# EAGLE design 1604_lora_rak811 (EAGLE 9.6.2)
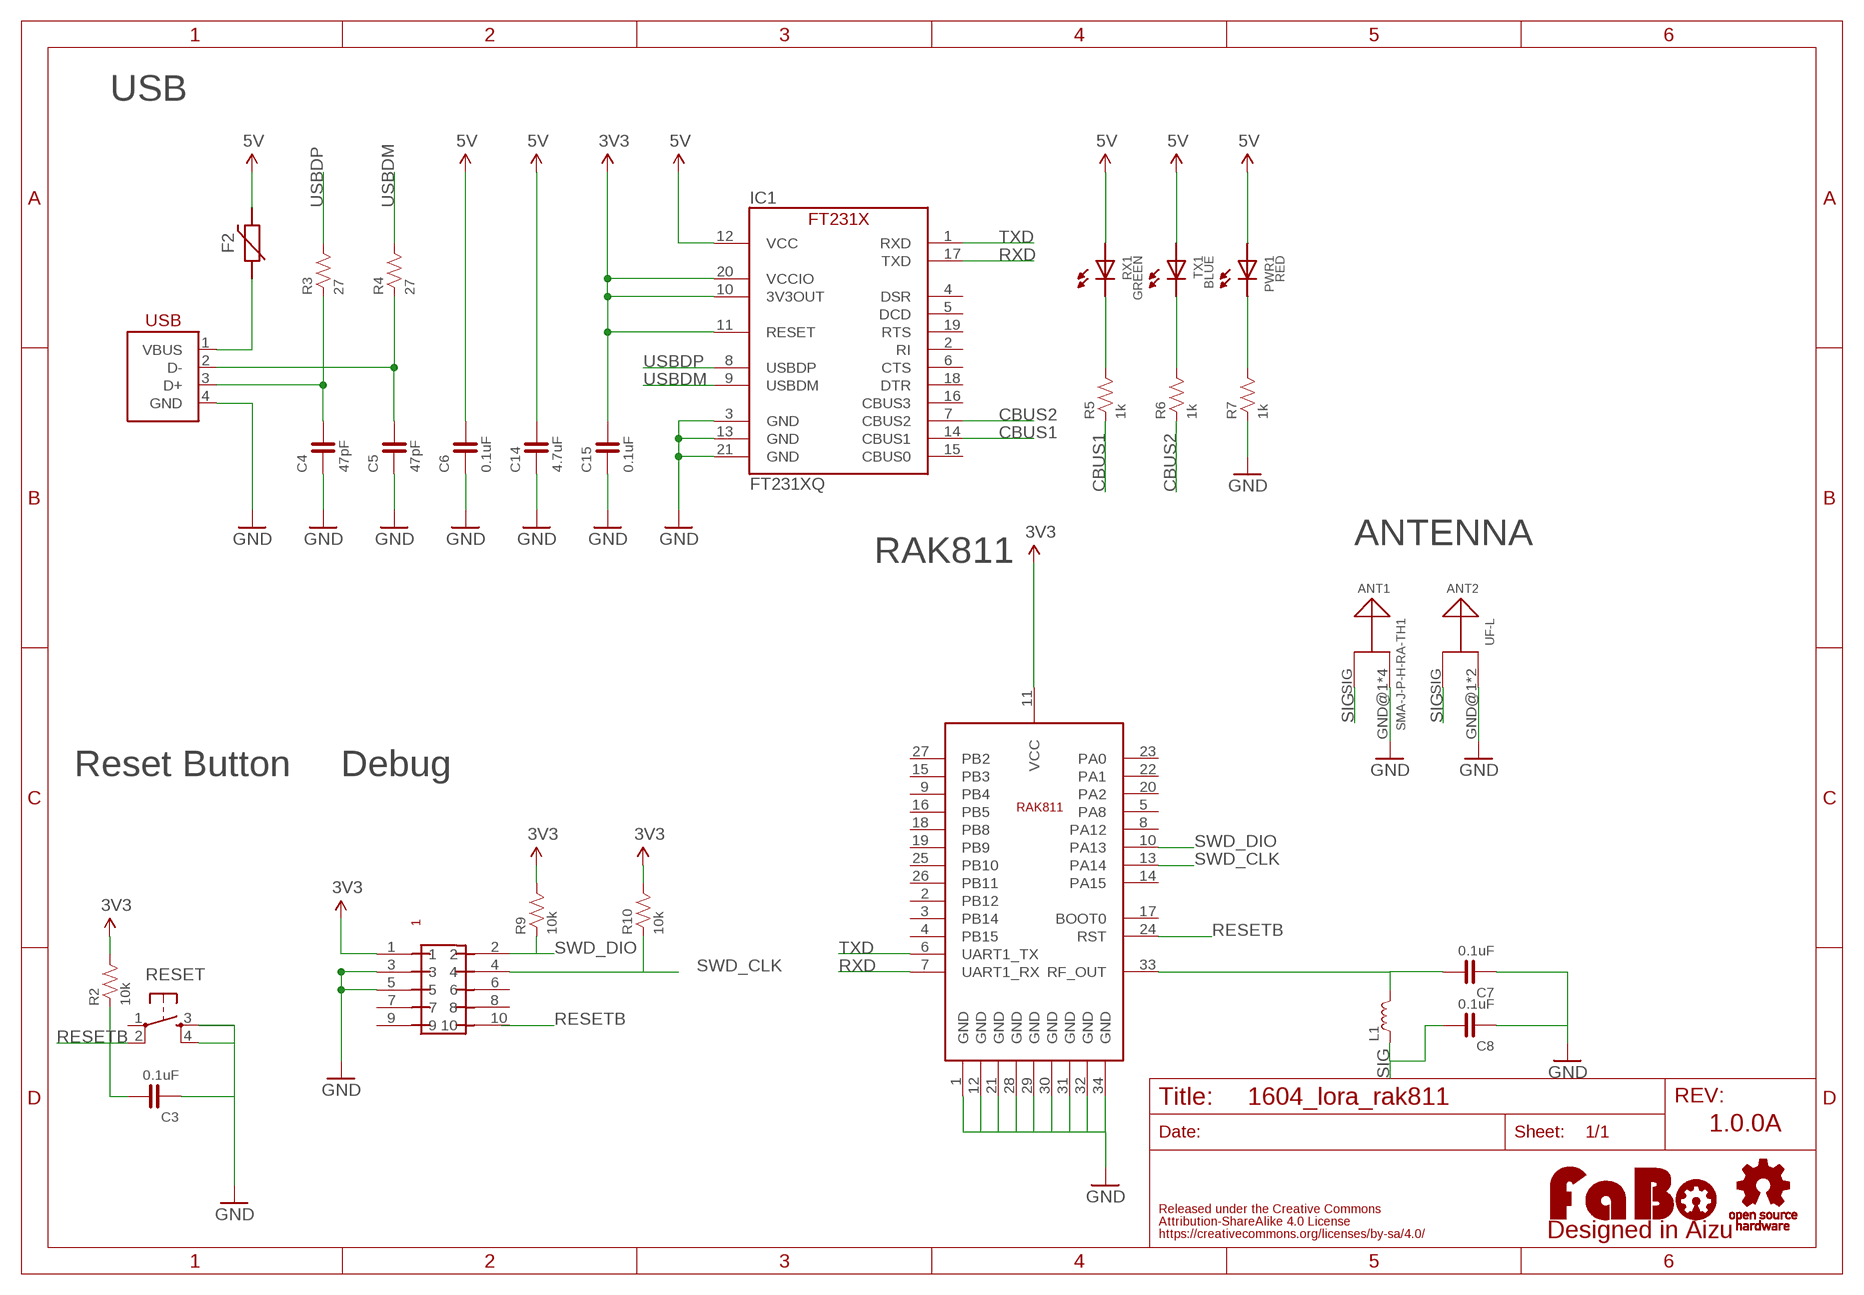
[diagram p0: schematic, sheet 1]

## Parts
ANT1  SMA-J-P-H-RA-TH1  ANTENA_SMA-J-P-H-RA-TH1  [SMA–J–P–H–RA–TH1]
ANT2  UF-L  ANTENA_HIROSE-UF-L  [HIROSE-UF-L]
C3  0.1uF  CAPACITOR-0603_NARROW  [0603-NARROW]
C4  47pF  CAPACITOR-0603_NARROW  [0603-NARROW]
C5  47pF  CAPACITOR-0603_NARROW  [0603-NARROW]
C6  0.1uF  CAPACITOR-0603_NARROW  [0603-NARROW]
C7  0.1uF  CAPACITOR-0603_NARROW  [0603-NARROW]
C8  0.1uF  CAPACITOR-0603_NARROW  [0603-NARROW]
C14  4.7uF  CAPACITOR-0603_NARROW  [0603-NARROW]
C15  0.1uF  CAPACITOR-0603_NARROW  [0603-NARROW]
F2  POLYSWITCH  [NANOSMDC035F]
IC1  FT231XQ  [QFN-20_FT231X]
L1  COIL-0603  [0603]
PWR1  RED  LED-0603-NARROW  [0603-NARROW]
R2  10k  RESISTOR-0603-NARROW  [0603-NARROW]
R3  27  RESISTOR-0603-NARROW  [0603-NARROW]
R4  27  RESISTOR-0603-NARROW  [0603-NARROW]
R5  1k  RESISTOR-0603-NARROW  [0603-NARROW]
R6  1k  RESISTOR-0603-NARROW  [0603-NARROW]
R7  1k  RESISTOR-0603-NARROW  [0603-NARROW]
R9  10k  RESISTOR-0603-NARROW  [0603-NARROW]
R10  10k  RESISTOR-0603-NARROW  [0603-NARROW]
RESET  TACT-SWITCH-SMD_KMR2  [KMR2]
RX1  GREEN  LED-0603-NARROW  [0603-NARROW]
TX1  BLUE  LED-0603-NARROW  [0603-NARROW]
U$2  RAK811  [RAK811]
U$3  LOGO_OSHW-M_BOTTOM  [LOGO_OSHW_M_BOTTOM]
U$4  LOGO_FABO-M  [LOGO_FABO_MS]
U$8  PIN-HEADER-SMT(1.27MM)2X5  [PIN-HEADER-SMT(1.27MM)2X5]
USB1  USB-B_PTH  [USB-4AF103BS]

## Nets
3V3: C15.2 IC1.10(3V3OUT) IC1.11(RESET) IC1.20(VCCIO) R2.2 R9.2 R10.2 U$2.11(VCC) U$8.1
5V: C6.2 C14.2 F2.2 IC1.12(VCC) PWR1.ANODE RX1.ANODE TX1.ANODE
CBUS1: IC1.14(CBUS1) R5.1
CBUS2: IC1.7(CBUS2) R6.1
GND: ANT1.GND@1(GND) ANT1.GND@2(GND) ANT1.GND@3(GND) ANT1.GND@4(GND) ANT2.GND@1(GND) ANT2.GND@2(GND) C3.1 C4.1 C5.1 C6.1 C7.1 C8.1 C14.1 C15.1 IC1.3(GND) IC1.13(GND) IC1.21(GND) R7.1 RESET.3 RESET.4 U$2.1(GND) U$2.12(GND) U$2.21(GND) U$2.28(GND) U$2.29(GND) U$2.30(GND) U$2.31(GND) U$2.32(GND) U$2.34(GND) U$8.3 U$8.5 USB1.4(GND)
N$2: C7.2 L1.2 U$2.33(RF_OUT)
N$7: C5.2 R4.1 USB1.2(D-)
N$8: C4.2 R3.1 USB1.3(D+)
N$9: R5.2 RX1.CATHODE
N$10: R6.2 TX1.CATHODE
N$11: PWR1.CATHODE R7.2
RESETB: C3.2 R2.1 RESET.2 U$2.24(RST) U$8.10
RXD: IC1.17(TXD) U$2.7(UART1_RX)
SIG: ANT1.SIG ANT2.SIG C8.2 L1.1
SWD_CLK: R10.1 U$2.13(PA14) U$8.4
SWD_DIO: R9.1 U$2.10(PA13) U$8.2
TXD: IC1.1(RXD) U$2.6(UART1_TX)
USBDM: IC1.9(USBDM) R4.2
USBDP: IC1.8(USBDP) R3.2
VBUS1: F2.1 USB1.1(VBUS)
Unconnected: IC1.2(RI) IC1.4(DSR) IC1.5(DCD) IC1.6(CTS) IC1.15(CBUS0) IC1.16(CBUS3) IC1.18(DTR) IC1.19(RTS) RESET.1 U$2.2(PB12) U$2.3(PB14) U$2.4(PB15) U$2.5(PA8) U$2.8(PA12) U$2.9(PB4) U$2.14(PA15) U$2.15(PB3) U$2.16(PB5) U$2.17(BOOT0) U$2.18(PB8) U$2.19(PB9) U$2.20(PA2) U$2.22(PA1) U$2.23(PA0) U$2.25(PB10) U$2.26(PB11) U$2.27(PB2) U$8.6 U$8.7 U$8.8 U$8.9

## Notes on the sheet
- USB
- ANTENNA
- RAK811
- Reset Button | Debug
- 1.0.0A

## Library data of the parts
ANT1 ANT2 = FaBo-Antena:ANTENA
C3-C8 C14 C15 = FaBo-Capacitor:CAPACITOR: CAPACITOR
F2 = FaBo-Parts:POLYSWITCH
IC1 = FaBo-USB:FT231X
L1 = FaBo-Coil:COIL: RESISTOR
PWR1 RX1 TX1 = FaBo-LED:LED
R2-R7 R9 R10 = FaBo-Resistors:RESISTOR: RESISTOR
RESET = FaBo-Switch:TACT-SWITCH
U$2 = FaBo-LoRa:RAK811
U$3 = FaBo-Logo:LOGO_OSHW
U$4 = FaBo-Logo:LOGO_FABO
U$8 = GClue:PIN-HEADER-SMT(1.27MM)2X5: PIN-HEADER-SMT (1.27MM) 2x5
USB1 = FaBo-USB:USB

## Board
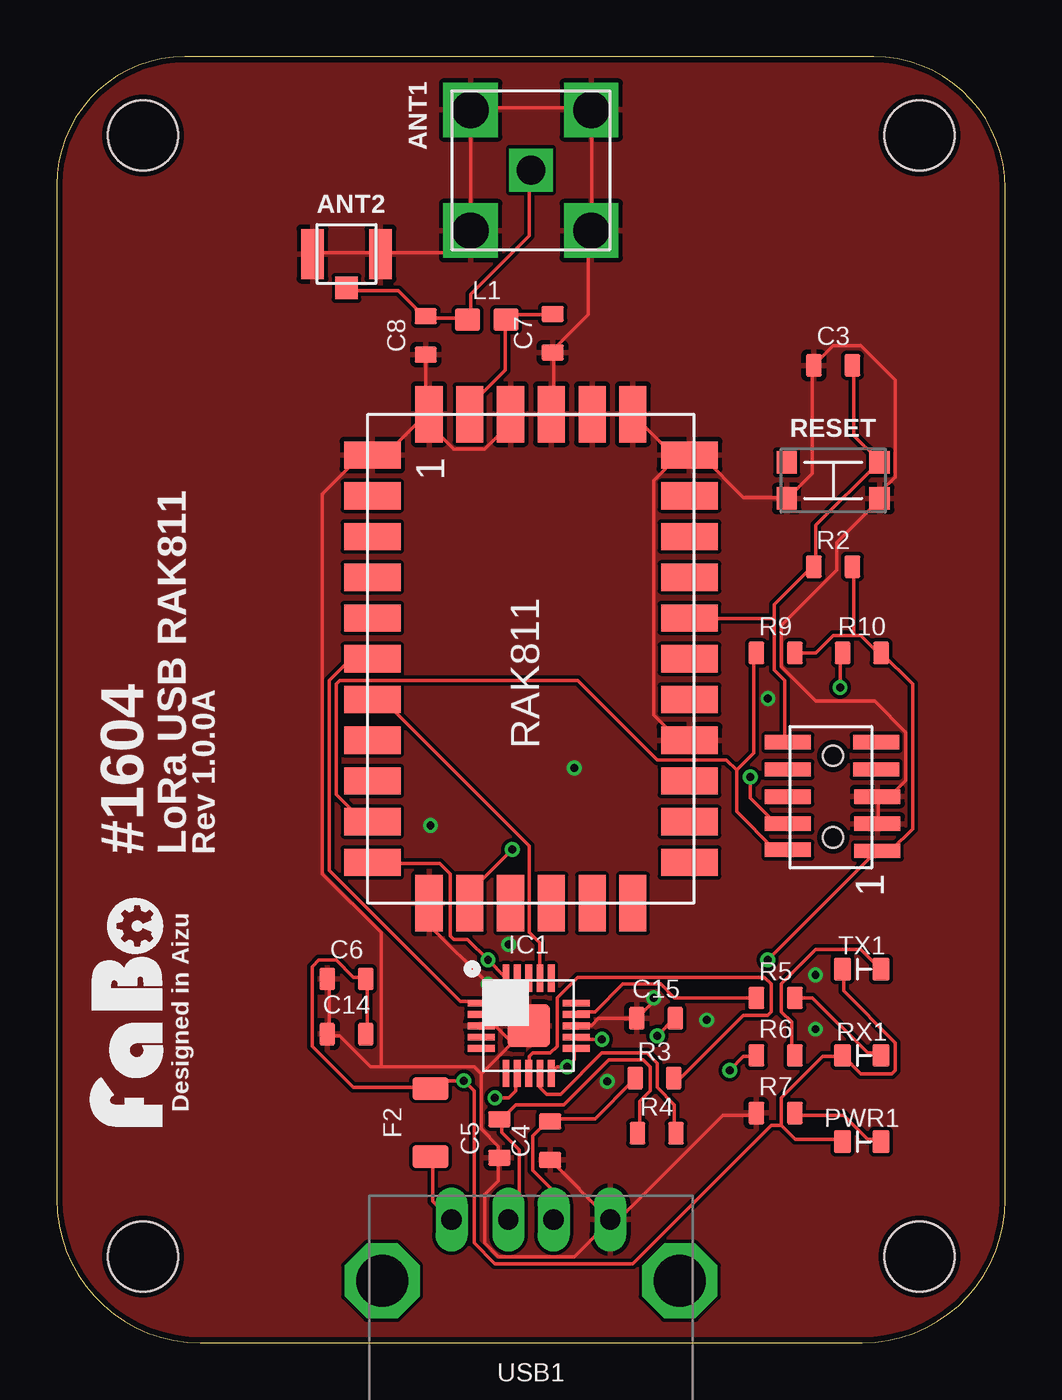
[diagram p1: board, top side]
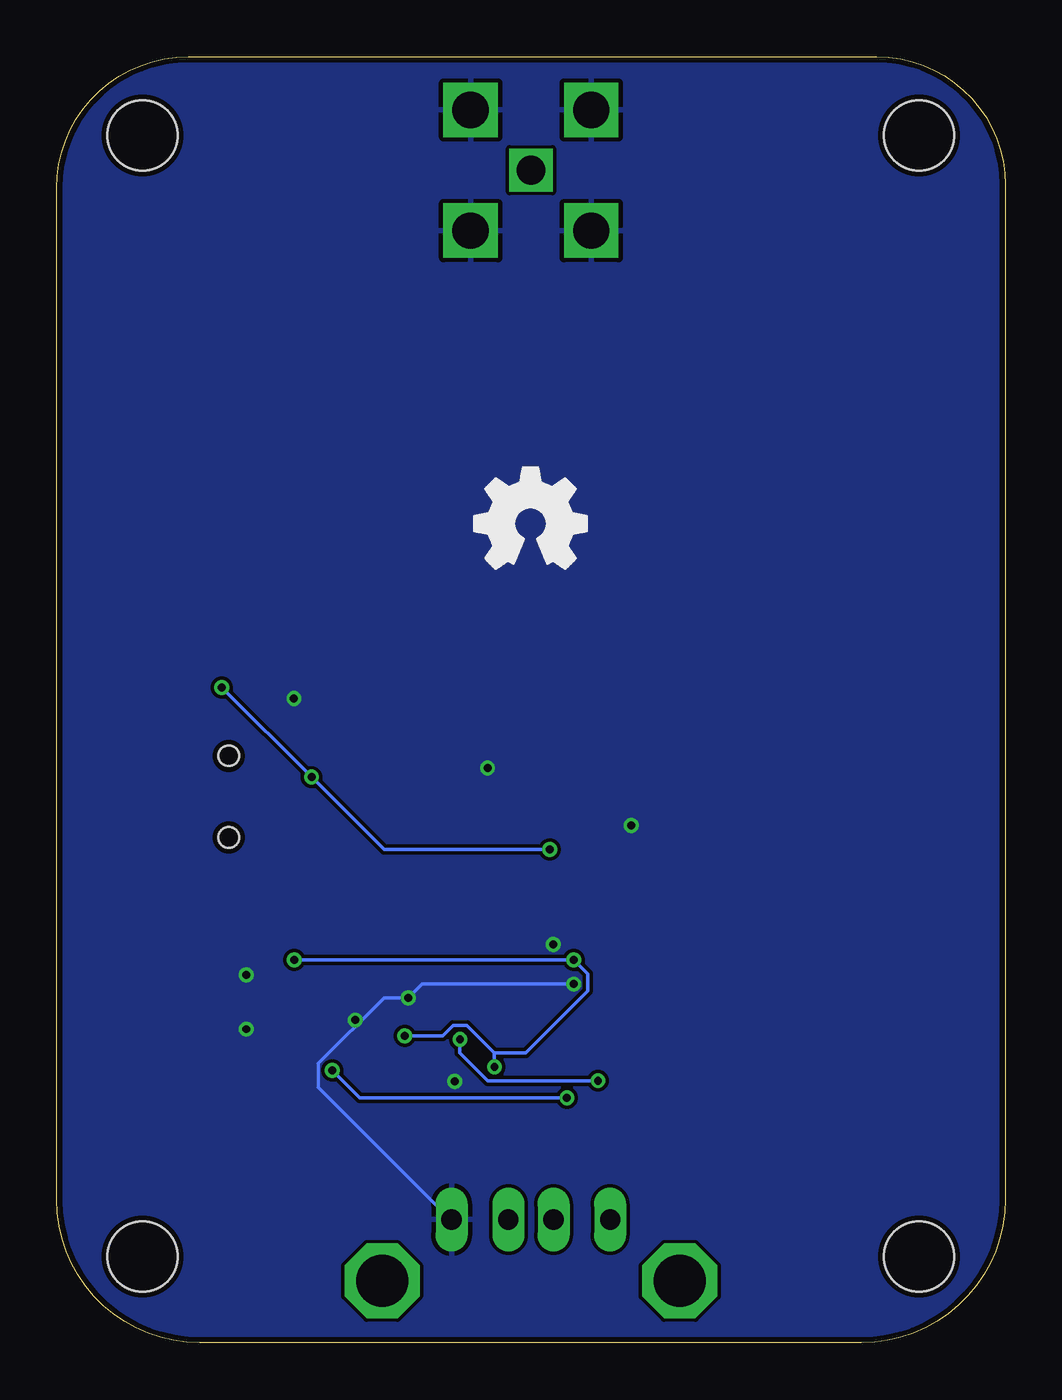
[diagram p2: board, bottom side, seen from below]

Size 41.89 x 56.82 mm. Coordinates in mm from the lower left corner, seen from the top.
Outline: 0,51.16 0,6.35 arc90 6.35,0 35.57,0 arc90 41.89,6.32 41.89,51.01 arc90 36.08,56.82 5.67,56.82 arc90 0,51.16
Copper layers (1*16): Top 0.035mm / dielectric 1.6mm / Bottom 0.035mm
Design rules "PCBway": minimum track width 6mil, minimum drill 12mil, track to track 6mil, track to pad 6mil, pad to pad 6mil, via to via 6mil, smd to smd 6mil, copper to edge 10mil, drill to drill 10mil, minimum pad ring 10mil, minimum via ring 6mil, stop-mask expansion 2mil, vias tented up to drill 100mil, thermal gap 8mil
Holes 3.1 mm at 3.81,53.34 38.1,53.34 38.1,3.81 3.81,3.81

### Footprints (pad centres in the part's own frame; a part is rotated, then mirrored left to right if it is on the bottom)
SMA–J–P–H–RA–TH1 = drill 1.6 square: GND@1 -2.665,2.665; GND@2 2.665,2.665; GND@3 -2.665,-2.665; GND@4 2.665,-2.665 | drill 1.27 square: SIG 0,0
HIROSE-UF-L = smd 1 x 2.2: GND@1 -1.5,0; GND@2 1.5,0 | smd 1 x 1: SIG 0,-1.5
0603-NARROW = smd 0.71 x 1: 1 -0.85,0; 2 0.85,0
NANOSMDC035F = smd 1 x 1.6: 1 -1.5,0; 2 1.5,0
QFN-20_FT231X = smd 1.2 x 0.3: 1 -2.1,1; 2 -2.1,0.5; 3 -2.1,0; 4 -2.1,-0.5; 5 -2.1,-1; 11 2.1,-1; 12 2.1,-0.5; 13 2.1,0; 14 2.1,0.5; 15 2.1,1 | smd 0.3 x 1.2: 6 -1,-2.1; 7 -0.5,-2.1; 8 0,-2.1; 9 0.5,-2.1; 10 1,-2.1; 16 1,2.1; 17 0.5,2.1; 18 0,2.1; 19 -0.5,2.1; 20 -1,2.1 | smd 1.9 x 1.9: 21 0,0
0603 = smd 1.1 x 1: 1 -0.85,0; 2 0.85,0
0603-NARROW' = smd 0.75 x 1: ANODE -0.85,0; CATHODE 0.85,0
KMR2 = smd 0.9 x 1: 1 -2.05,0.8; 2 2.05,0.8; 3 2.05,-0.8; 4 -2.05,-0.8
RAK811 = smd 1.2 x 2.5: 1 -9,-7; 2 -7.2,-7; 3 -5.4,-7; 4 -3.6,-7; 5 -1.8,-7; 6 0,-7; 7 1.8,-7; 8 3.6,-7; 9 5.4,-7; 10 7.2,-7; 11 9,-7; 18 9,7; 19 7.2,7; 20 5.4,7; 21 3.6,7; 22 1.8,7; 23 0,7; 24 -1.8,7; 25 -3.6,7; 26 -5.4,7; 27 -7.2,7; 28 -9,7 | smd 2.5 x 1.2: 12 10.8,-4.5; 13 10.8,-2.7; 14 10.8,-0.9; 15 10.8,0.9; 16 10.8,2.7; 17 10.8,4.5; 29 -10.8,4.5; 30 -10.8,2.7; 31 -10.8,0.9; 32 -10.8,-0.9; 33 -10.8,-2.7; 34 -10.8,-4.5
PIN-HEADER-SMT(1.27MM)2X5 = smd 0.635 x 2.032: 1 -2.4,-1.95; 2 -2.35,2; 3 -1.2,-1.95; 4 -1.2,2; 5 0,-1.95; 6 0,2; 7 1.2,-1.9; 8 1.2,2; 9 2.4,-1.9; 10 2.4,2 | hole 0.9: 1.8,0; -1.8,0
USB-4AF103BS = drill 0.9 long: 1 3.5,0; 2 1,0; 3 -1,0; 4 -3.5,0 | drill 2.3 octagon: P$1 -6.57,2.71; P$2 6.57,2.71

### Placement (x,y rotation side)
ANT1  20.95,51.8 0 top
ANT2  12.8,48.1 0 top
C3  34.29,43.18 0 top
C4  21.79,8.93 90 top
C5  19.55,9.03 90 top
C6  12.8,16.08 0 top
C7  21.9,44.6 90 top
C8  16.3,44.5 90 top
C14  12.8,13.64 0 top
C15  26.47,14.34 0 top
F2  16.51,9.73 90 top
IC1  20.84,14.01 0 top
L1  19,45.2 0 top
PWR1  RED  [0603-NARROW']  35.56,8.89 0 top
R2  34.29,34.29 0 top
R3  26.4,11.7 0 top
R4  26.5,9.26 0 top
R5  31.75,15.24 0 top
R6  31.75,12.7 0 top
R7  31.75,10.16 0 top
R9  31.75,30.48 0 top
R10  35.56,30.48 0 top
RESET  34.29,38.1 0 top
RX1  GREEN  [0603-NARROW']  35.56,12.7 0 top
TX1  BLUE  [0603-NARROW']  35.56,16.51 0 top
U$2  20.95,30.22 270 top
U$3  20.95,36.2 0 top
U$4  5.08,14.61 90 top
U$8  34.29,24.13 90 top
USB1  20.95,5.45 180 top

### Tracks (layer width: path | path; a pad name or v marks a point on that pad's centre or on a via)
3V3  (via drill 0.35)
  Top 0.152: R9.2 33.53,30.48 34.29,31.24 35.2,31.24 | 35.2,31.24 35.51,31.24 36.27,30.48 R10.2 36.42,30.48 37.8,29.11 37.8,22.71 36.88,21.79 36.27,21.79 U$8.1 36.12,21.64 v31.39,16.92 | 35.2,31.24 35.2,34.29 R2.2 | v26.52,13.56 27.28,14.33 C15.2 | IC1.10 21.95,12.04 22.1,12.19 v22.55,12.19 22.86,12.5 22.86,12.95 IC1.11 | IC1.20 19.81,16.15 v19.05,16.92 18.14,17.83 17.53,17.83 17.37,17.98 17.37,20.73 16.92,21.18 14.02,21.18 U$2.11
  Bottom 0.152: v26.52,13.56 24.84,13.56 24.38,14.02 23.77,14.02 22.55,12.8 | v22.55,12.19 22.55,12.8 | 22.55,12.8 21.18,12.8 18.44,15.54 18.44,16.31 v19.05,16.92 v31.39,16.92
5V  (via drill 0.35)
  Top 0.152: 32,9.6 32.61,8.99 34.59,8.99 PWR1.ANODE | 32,9.6 32,10.82 33.83,12.65 34.59,12.65 RX1.ANODE 34.75,12.65 35.51,11.89 36.88,11.89 37.03,12.04 37.03,13.26 34.75,15.54 34.75,16.46 TX1.ANODE | C14.2 13.72,13.72 13.72,16 C6.2 13.56,16.15 13.11,16.15 12.34,16.92 11.58,16.92 11.28,16.61 11.28,13.11 13.11,11.28 16.46,11.28 F2.2 16.61,11.28 16.92,11.58 v17.98,11.58 18.44,11.12 18.44,4.42 19.36,3.5 25.45,3.5 31.55,9.6 32,9.6 | v24.08,13.41 23.01,13.41 IC1.12
  Bottom 0.152: v24.08,13.41 24.08,12.8 22.86,11.58 v17.98,11.58
CBUS1
  Top 0.152: R5.1 27.28,15.24 26.67,15.85 24.99,15.85 23.77,14.63 23.01,14.63 IC1.14
CBUS2  (via drill 0.35)
  Top 0.152: v29.72,12.04 30.33,12.65 30.79,12.65 R6.1 | v19.36,10.82 19.96,10.82 20.27,11.12 20.27,11.89 IC1.7
  Bottom 0.152: v29.72,12.04 28.5,10.82 v19.36,10.82
GND  (via drill 0.35)
  Top 0.152: C6.1 12.04,16 12.04,13.72 C14.1 12.04,13.56 12.5,13.56 13.87,12.19 14.33,12.19 | 18.75,11.89 18.75,9.45 19.51,8.69 19.51,8.23 C5.1 19.51,8.08 19.51,7.16 18.9,6.55 18.9,4.42 19.51,3.81 22.86,3.81 24.38,5.33 USB1.4 | 20.12,13.26 20.73,13.87 IC1.21 20.12,13.26 | 20.12,13.26 18.75,11.89 | 20.12,13.26 19.36,14.02 18.75,14.02 IC1.3 | 14.33,12.19 18.44,12.19 18.75,11.89 | IC1.13 23.01,14.02 23.62,14.02 23.93,14.33 25.6,14.33 C15.1 25.76,14.48 26.36,15.09 v26.36,15.24 | C4.1 24.38,5.49 USB1.4 | R7.1 30.79,10.06 29.41,10.06 24.84,5.49 24.54,5.49 USB1.4 | v19.05,15.85 16.46,18.44 16.46,19.36 U$2.12 | ANT2.GND@1 11.43,48.16 14.17,48.16 ANT2.GND@2 14.33,48.16 17.22,48.16 18.14,49.07 ANT1.GND@3 18.29,49.23 18.29,54.41 ANT1.GND@1 18.29,54.56 23.47,54.56 ANT1.GND@2 23.62,54.41 23.62,49.23 ANT1.GND@4 23.47,49.07 23.47,45.41 21.95,43.89 C7.1 21.95,43.74 21.95,41.15 U$2.31 | C8.1 16.31,43.59 16.31,41.15 U$2.34 | 16.15,40.84 16.31,41 U$2.34 | 16.15,40.84 14.63,39.32 14.02,39.32 U$2.1 13.87,39.17 13.41,39.17 11.73,37.49 11.73,20.73 14.33,18.14 14.33,12.19 | U$2.31 21.79,41 20.12,41 U$2.32 19.96,41 19.96,40.54 18.9,39.47 17.53,39.47 16.15,40.84 | U$2.31 21.95,41 23.62,41 U$2.30 23.77,41 25.3,41 U$2.29 25.45,41 27.28,39.17 27.43,39.17 | 16.15,40.84 U$2.34 | U$8.3 36.27,23.01 36.27,24.08 U$8.5 36.27,24.23 36.88,24.23 37.49,24.84 37.49,26.98 36.12,28.35 33.53,28.35 32,29.87 32,31.7 34.44,34.14 34.44,35.36 36.27,37.19 RESET.3 36.42,37.34 36.42,37.64 37.03,38.25 37.03,42.52 35.51,44.04 34.29,44.04 33.53,43.28 C3.1 33.38,43.13 33.38,38.41 32.31,37.34 RESET.4 32.16,37.34 30.33,37.34 28.5,39.17 28.04,39.17 U$2.28
  Top 0.152: 27.43,39.17 26.36,38.1 26.36,27.74 27.43,26.67 27.89,26.67 U$2.21 | 27.43,39.17 27.89,39.17 U$2.28 | 27.43,39.17 U$2.28
  Bottom 0.152: USB1.4 24.54,5.49 30.33,11.28 30.33,12.34 27.43,15.24 v26.36,15.24 25.76,15.85 v19.05,15.85
  other vias: 22.86,25.4 16.51,22.86 28.71,14.26 24.31,11.56 33.51,13.86 33.51,16.26 31.41,28.46 19.96,17.6
  pour Bottom: 0,0 41.91,0 41.91,57.15 0,57.15
  pour Top: 0,0 41.91,0 41.91,57.15 0,57.15
N$2
  Top 0.152: C7.2 21.79,45.41 20.12,45.41 19.96,45.26 L1.2 19.81,45.11 19.81,42.98 18.29,41.45 18.29,41.15 U$2.33
N$7
  Top 0.152: USB1.2 19.96,5.49 20.42,5.94 20.42,8.53 19.66,9.3 19.66,9.75 C5.2 19.66,9.91 20.27,10.52 22.4,10.52 24.38,12.5 25.91,12.5 26.21,12.19 26.21,11.12 25.76,10.67 25.76,9.3 R4.1
N$8
  Top 0.152: R3.1 25.45,11.58 23.77,9.91 21.79,9.91 C4.2 21.64,9.75 21.03,9.14 21.03,7.62 21.79,6.86 21.79,5.49 USB1.3
N$9
  Top 0.152: R5.2 33.38,15.24 35.81,12.8 36.27,12.8 RX1.CATHODE
N$10
  Top 0.152: R6.2 32.46,12.8 32.46,14.17 32,14.63 32,15.85 33.53,17.37 35.51,17.37 36.27,16.61 TX1.CATHODE
N$11
  Top 0.152: PWR1.CATHODE 36.27,8.99 35.81,8.99 34.75,10.06 32.61,10.06 R7.2
RESETB
  Top 0.152: C3.2 35.2,43.13 35.2,40.08 36.27,39.01 RESET.2 36.27,38.86 33.53,36.12 33.53,34.29 R2.1 33.38,34.29 31.7,32.61 31.7,32 | 31.7,32 31.7,29.72 32.16,29.26 32.16,26.67 U$8.10 | 31.7,32 28.04,32 U$2.24
RXD
  Top 0.152: IC1.17 21.34,16.15 21.34,17.68 20.88,18.14 20.88,21.95 14.48,28.35 14.02,28.35 U$2.7
SIG
  Top 0.152: ANT2.SIG 12.8,46.48 15.09,46.48 16.15,45.41 C8.2 16.31,45.26 18.14,45.26 L1.1 18.29,45.26 18.29,46.33 20.88,48.92 20.88,51.66 ANT1.SIG
SWD_CLK  (via drill 0.35)
  Top 0.152: v34.59,28.96 34.59,30.48 R10.1 | v30.63,24.99 30.63,24.08 31.7,23.01 32.16,23.01 U$8.4 | v20.12,21.79 18.29,19.96 18.29,19.51 U$2.13
  Bottom 0.152: v34.59,28.96 v30.63,24.99 27.43,21.79 v20.12,21.79
SWD_DIO
  Top 0.152: 30.02,25.3 30.79,26.06 30.79,30.48 R9.1 | 30.02,25.3 30.02,23.47 31.7,21.79 32.16,21.79 U$8.2 | 30.02,25.3 29.57,25.76 26.52,25.76 23.01,29.26 12.5,29.26 12.34,29.11 12.34,24.23 13.41,23.16 13.87,23.16 U$2.10
TXD
  Top 0.152: IC1.1 18.59,15.09 17.83,15.09 12.04,20.88 12.04,29.26 12.95,30.18 13.87,30.18 U$2.6
USBDM
  Top 0.152: R4.2 27.28,9.3 27.28,10.52 26.52,11.28 26.52,12.34 26.06,12.8 24.08,12.8 22.25,10.97 21.64,10.97 21.34,11.28 21.34,11.89 IC1.9
USBDP
  Top 0.152: R3.2 27.28,11.73 27.58,11.73 30.33,14.48 31.39,14.48 31.55,14.63 31.55,15.85 31.24,16.15 23.01,16.15 22.1,15.24 22.1,13.11 21.79,12.8 21.03,12.8 20.88,12.65 20.88,12.04 IC1.8
VBUS1
  Top 0.152: F2.1 16.61,8.23 16.61,6.25 17.37,5.49 USB1.1

### Text on the board
tPlace: #1604 | LoRa USB RAK811 | Rev 1.0.0A | Designed in Aizu